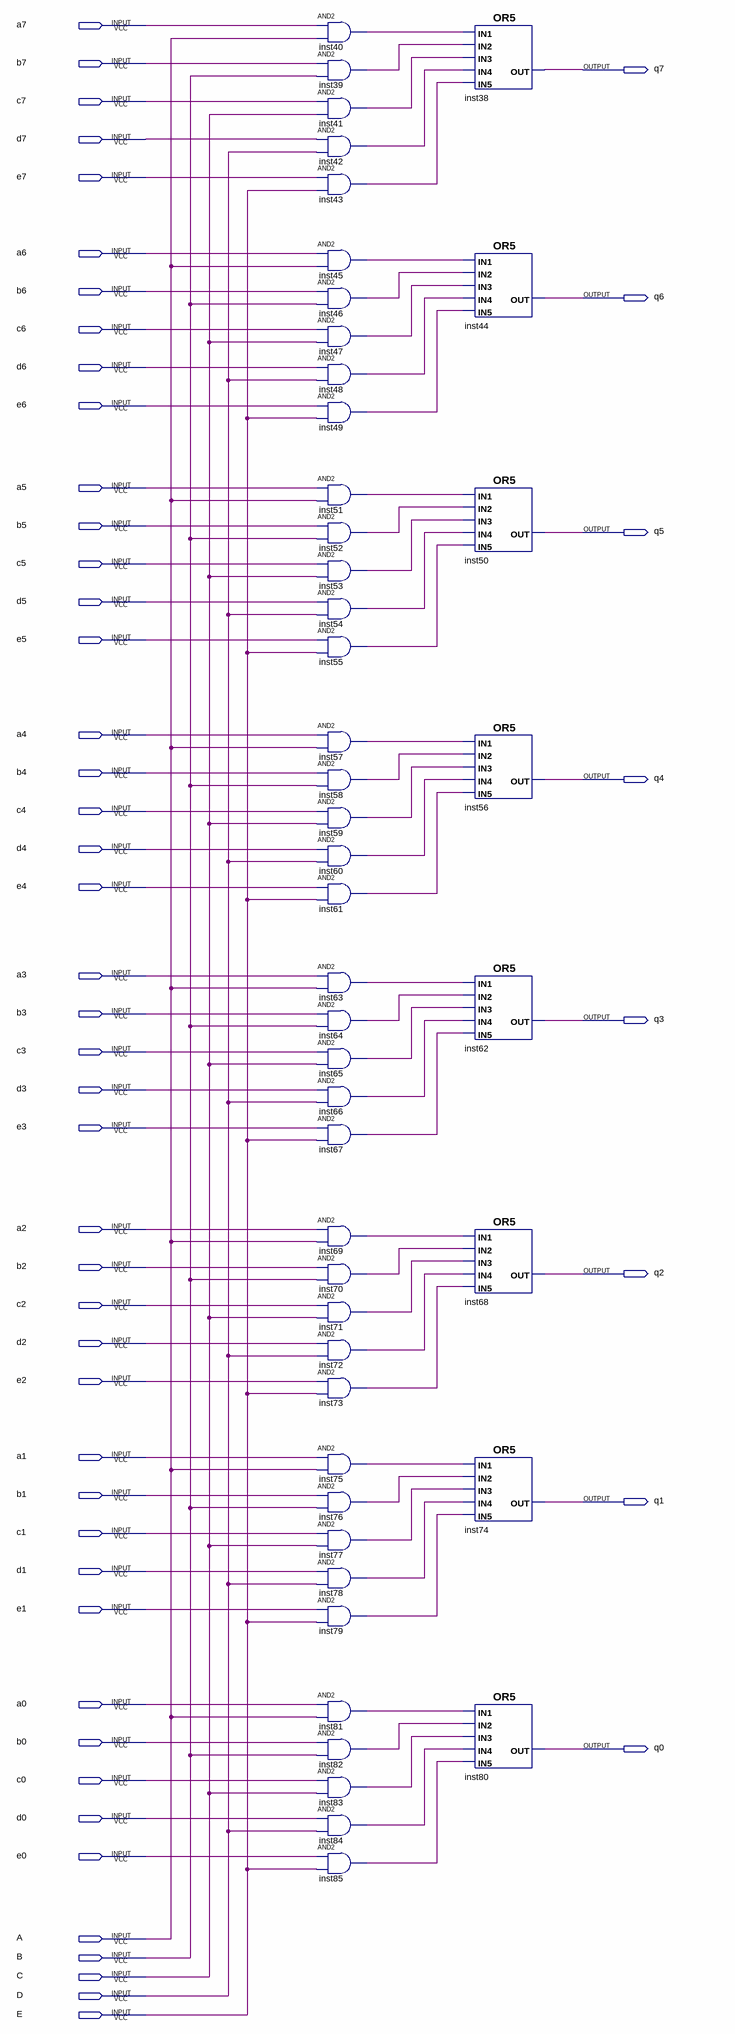
[diagram p0: schematic sheet]
// Quartus schematic choose5.bdf as structural Verilog: 48 symbols, 53 pins
module choose5 (
  input  a7,
  input  b7,
  input  c7,
  input  d7,
  input  e7,
  input  a6,
  input  b6,
  input  c6,
  input  d6,
  input  e6,
  input  a5,
  input  b5,
  input  c5,
  input  d5,
  input  e5,
  input  a4,
  input  b4,
  input  c4,
  input  d4,
  input  e4,
  input  a3,
  input  b3,
  input  c3,
  input  d3,
  input  e3,
  input  a2,
  input  b2,
  input  c2,
  input  d2,
  input  e2,
  input  a1,
  input  b1,
  input  c1,
  input  d1,
  input  e1,
  input  a0,
  input  b0,
  input  c0,
  input  d0,
  input  e0,
  input  A,
  input  B,
  input  C,
  input  D,
  input  E,
  output q7,
  output q6,
  output q5,
  output q4,
  output q3,
  output q2,
  output q1,
  output q0
);

  wire inst39_out, inst40_out, inst41_out, inst42_out, inst43_out, inst45_out, inst46_out, inst47_out,
       inst48_out, inst49_out, inst51_out, inst52_out, inst53_out, inst54_out, inst55_out, inst57_out,
       inst58_out, inst59_out, inst60_out, inst61_out, inst63_out, inst64_out, inst65_out, inst66_out,
       inst67_out, inst69_out, inst70_out, inst71_out, inst72_out, inst73_out, inst75_out, inst76_out,
       inst77_out, inst78_out, inst79_out, inst81_out, inst82_out, inst83_out, inst84_out, inst85_out;

  and inst40 (inst40_out, a7, A);
  and inst39 (inst39_out, b7, B);
  and inst41 (inst41_out, c7, C);
  and inst42 (inst42_out, d7, D);
  and inst43 (inst43_out, e7, E);
  and inst45 (inst45_out, a6, A);
  and inst46 (inst46_out, b6, B);
  and inst47 (inst47_out, c6, C);
  and inst48 (inst48_out, d6, D);
  and inst49 (inst49_out, e6, E);
  and inst51 (inst51_out, a5, A);
  and inst52 (inst52_out, b5, B);
  and inst53 (inst53_out, c5, C);
  and inst54 (inst54_out, d5, D);
  and inst55 (inst55_out, e5, E);
  and inst57 (inst57_out, a4, A);
  and inst58 (inst58_out, b4, B);
  and inst59 (inst59_out, c4, C);
  and inst60 (inst60_out, d4, D);
  and inst61 (inst61_out, e4, E);
  and inst63 (inst63_out, a3, A);
  and inst64 (inst64_out, b3, B);
  and inst65 (inst65_out, c3, C);
  and inst66 (inst66_out, d3, D);
  and inst67 (inst67_out, e3, E);
  and inst69 (inst69_out, a2, A);
  and inst70 (inst70_out, b2, B);
  and inst71 (inst71_out, c2, C);
  and inst72 (inst72_out, d2, D);
  and inst73 (inst73_out, e2, E);
  and inst75 (inst75_out, a1, A);
  and inst76 (inst76_out, b1, B);
  and inst77 (inst77_out, c1, C);
  and inst78 (inst78_out, d1, D);
  and inst79 (inst79_out, e1, E);
  and inst81 (inst81_out, a0, A);
  and inst82 (inst82_out, b0, B);
  and inst83 (inst83_out, c0, C);
  and inst84 (inst84_out, d0, D);
  and inst85 (inst85_out, e0, E);
  or inst38 (q7, inst40_out, inst39_out, inst41_out, inst42_out, inst43_out);
  or inst44 (q6, inst45_out, inst46_out, inst47_out, inst48_out, inst49_out);
  or inst50 (q5, inst51_out, inst52_out, inst53_out, inst54_out, inst55_out);
  or inst56 (q4, inst57_out, inst58_out, inst59_out, inst60_out, inst61_out);
  or inst62 (q3, inst63_out, inst64_out, inst65_out, inst66_out, inst67_out);
  or inst68 (q2, inst69_out, inst70_out, inst71_out, inst72_out, inst73_out);
  or inst74 (q1, inst75_out, inst76_out, inst77_out, inst78_out, inst79_out);
  or inst80 (q0, inst81_out, inst82_out, inst83_out, inst84_out, inst85_out);
endmodule
